# EAGLE design uvnitr-stanice (EAGLE 9.6.2)
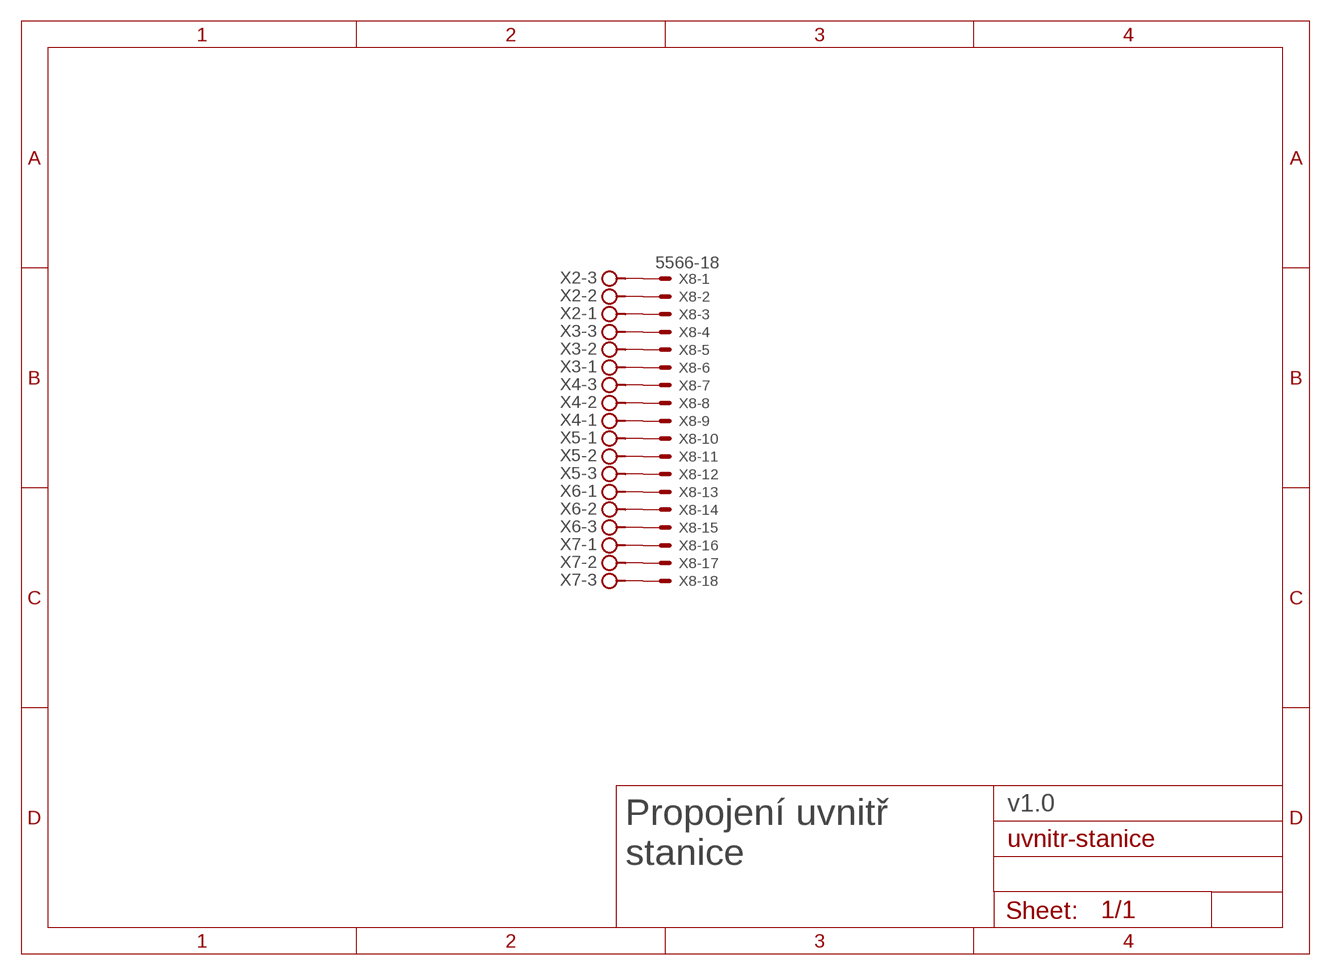
[diagram p0: schematic, sheet 1]

## Parts
X2  ARK500/3  [ARK500/3]
X3  ARK500/3  [ARK500/3]
X4  ARK500/3  [ARK500/3]
X5  ARK500/3  [ARK500/3]
X6  ARK500/3  [ARK500/3]
X7  ARK500/3  [ARK500/3]
X8  5566-18  [5566-18]

## Nets
N$1: X2.1 X8.3
N$2: X2.2 X8.2
N$3: X2.3 X8.1
N$4: X3.1 X8.6
N$5: X3.2 X8.5
N$6: X3.3 X8.4
N$7: X4.1 X8.9
N$8: X4.2 X8.8
N$9: X4.3 X8.7
N$10: X5.1 X8.10
N$11: X5.2 X8.11
N$12: X5.3 X8.12
N$13: X6.1 X8.13
N$14: X6.2 X8.14
N$15: X6.3 X8.15
N$16: X7.1 X8.16
N$17: X7.2 X8.17
N$18: X7.3 X8.18

## Notes on the sheet
- v1.0
- Propojení uvnitř
  stanice

## Library data of the parts
X2-X7 = con-malina:ARK500/3
X8 = con-molex:5566-18: Mini FIT connector 18 pol Source: http://www.molex.com; MF: MOLEX; OC_FARNELL: unknown; OC_NEWARK: unknown

## Board
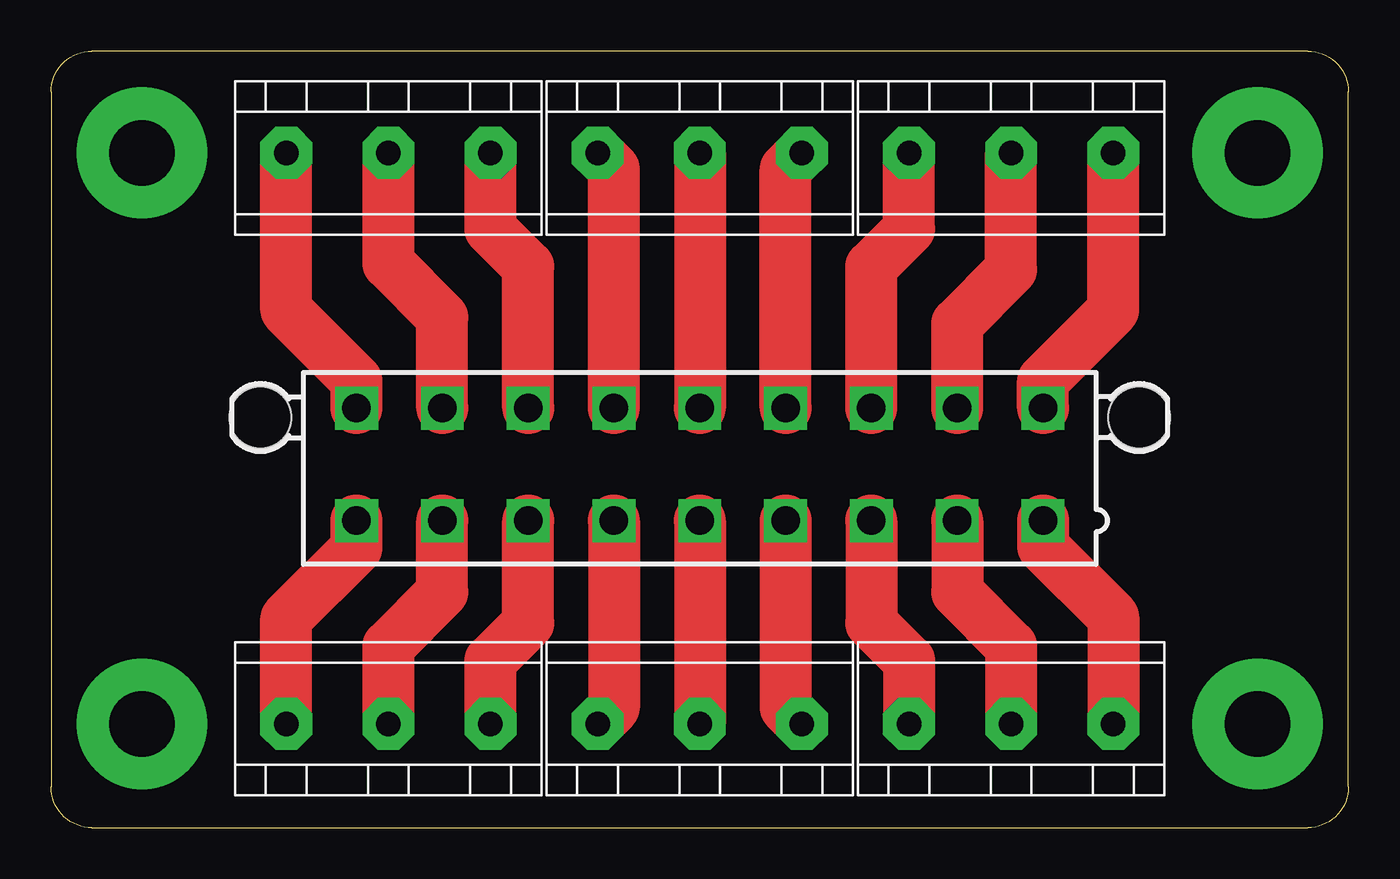
[diagram p1: board, top side]
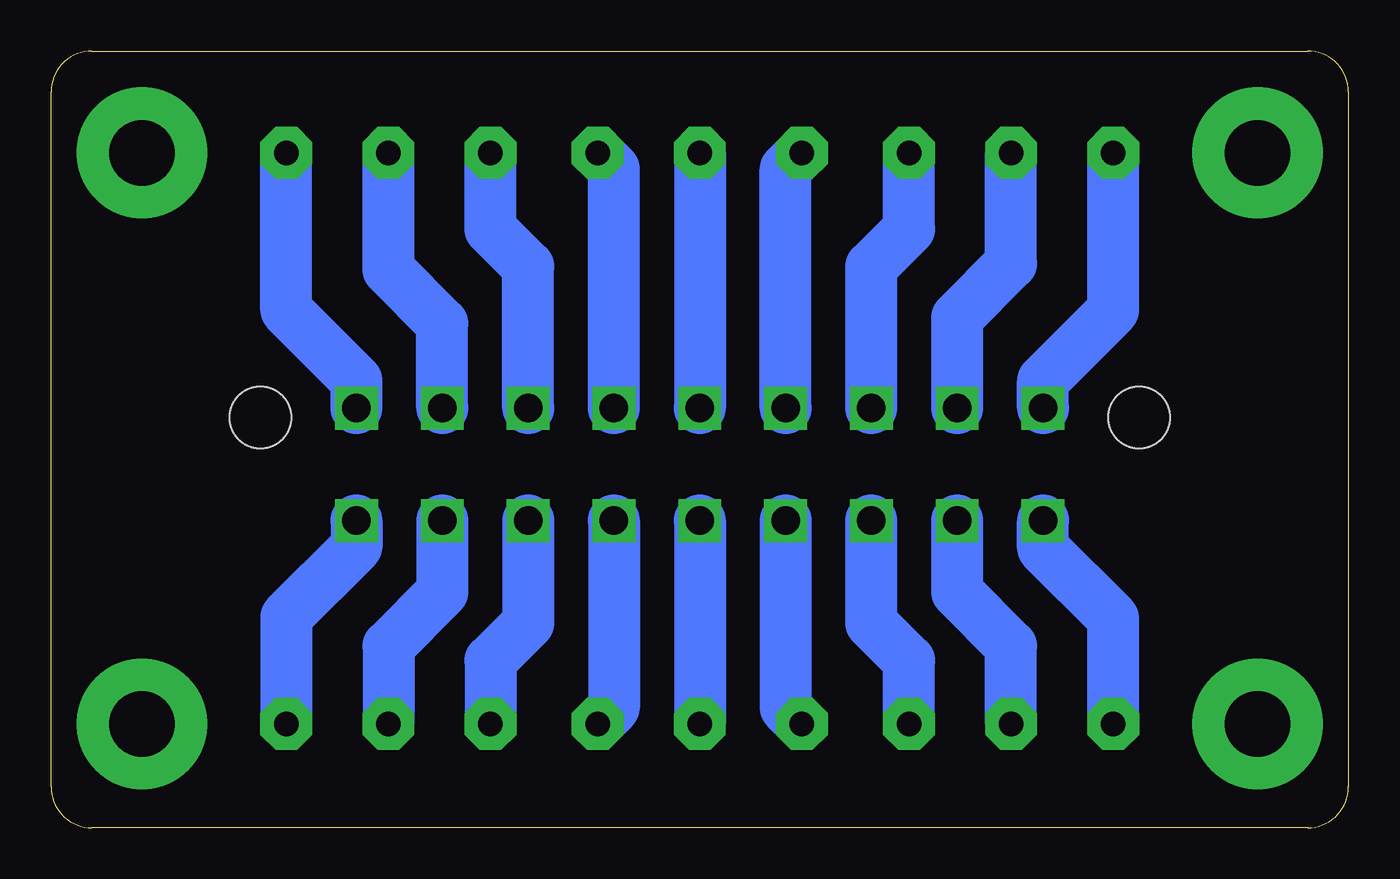
[diagram p2: board, bottom side, seen from below]

Size 63.5 x 38 mm. Coordinates in mm from the lower left corner, seen from the top.
Outline: 2,0 61.5,0 arc90 63.5,2 63.5,36 arc90 61.5,38 2,38 arc90 0,36 0,2 arc90 2,0
Copper layers (1*16): Top 0.035mm / dielectric 0.15mm / Bottom 0.035mm
Design rules "default": minimum track width 6mil, minimum drill 0.35mm, track to track 6mil, track to pad 6mil, pad to pad 6mil, via to via 6mil, smd to smd 6mil, copper to edge 40mil, drill to drill 6mil, minimum pad ring 10mil, minimum via ring 8mil, stop-mask expansion 4mil, vias tented up to drill 0mil, thermal gap 10mil

### Footprints (pad centres in the part's own frame; a part is rotated, then mirrored left to right if it is on the bottom)
ARK500/3 = drill 1.2 pad 2.54 octagon: 1 -5,0; 2 0,0; 3 5,0
5566-18 = drill 1.4 square: 1 16.8,-2.75; 2 12.6,-2.75; 3 8.4,-2.75; 4 4.2,-2.75; 5 0,-2.75; 6 -4.2,-2.75; 7 -8.4,-2.75; 8 -12.6,-2.75; 9 -16.8,-2.75; 10 16.8,2.75; 11 12.6,2.75; 12 8.4,2.75; 13 4.2,2.75; 14 0,2.75; 15 -4.2,2.75; 16 -8.4,2.75; 17 -12.6,2.75; 18 -16.8,2.75 | hole 3: 21.5,2.29; -21.5,2.29

### Placement (x,y rotation side)
X2  46.99,5.08 0 top
X3  31.75,5.08 0 top
X4  16.51,5.08 0 top
X5  46.99,33.02 180 top
X6  31.75,33.02 180 top
X7  16.51,33.02 180 top
X8  31.75,17.78 0 top

### Tracks (layer width: path | path; a pad name or v marks a point on that pad's centre or on a via)
N$1
  Bottom 2.54: X8.3 40.15,10.02 41.99,8.18 X2.1
N$2
  Bottom 2.54: X8.2 44.35,11.53 46.99,8.89 X2.2
N$3
  Bottom 2.54: X8.1 48.55,13.76 51.99,10.32 X2.3
N$4
  Bottom 2.54: X8.6 27.55,5.88 X3.1
N$5
  Bottom 2.54: X8.5 X3.2
N$6
  Bottom 2.54: X8.4 35.95,5.88 X3.3
N$7
  Bottom 2.54: X4.1 11.51,10.24 14.95,13.68 X8.9
N$8
  Bottom 2.54: X4.2 16.51,8.89 19.15,11.53 X8.8
N$9
  Bottom 2.54: X4.3 21.51,8.18 23.35,10.02 X8.7
N$10
  Bottom 2.54: X8.10 48.55,21.88 51.99,25.32 X5.1
N$11
  Bottom 2.54: X8.11 44.35,24.66 46.99,27.3 X5.2
N$12
  Bottom 2.54: X8.12 40.15,27.45 41.99,29.29 X5.3
N$13
  Bottom 2.54: X8.13 35.95,32.22 X6.1
N$14
  Bottom 2.54: X6.2 X8.14
N$15
  Bottom 2.54: X8.15 27.55,32.22 X6.3
N$16
  Bottom 2.54: X8.16 23.35,27.45 21.51,29.29 X7.1
N$17
  Bottom 2.54: X8.17 19.15,24.98 16.51,27.61 X7.2
N$18
  Bottom 2.54: X8.18 14.95,21.88 11.51,25.32 X7.3
N$19  (via drill 3.2 pad 6.4)
  other vias: 4.45,5.08
N$20  (via drill 3.2 pad 6.4)
  other vias: 4.45,33.02
N$21  (via drill 3.2 pad 6.4)
  other vias: 59.05,5.08
N$22
  Top 2.54: 48.55,20.53 48.55,21.88 51.99,25.32 51.99,33.02
N$23
  Top 2.54: 44.35,20.53 44.35,24.66 46.99,27.3 46.99,33.02
N$24
  Top 2.54: 40.15,20.53 40.15,27.45 41.99,29.29 41.99,33.02
N$25
  Top 2.54: 35.95,20.53 35.95,32.22 36.75,33.02
N$26
  Top 2.54: 31.75,33.02 31.75,20.53
N$27
  Top 2.54: 27.55,20.53 27.55,32.22 26.75,33.02
N$28
  Top 2.54: 23.35,20.53 23.35,27.45 21.51,29.29 21.51,33.02
N$29
  Top 2.54: 19.15,20.53 19.15,24.98 16.51,27.61 16.51,33.02
N$30
  Top 2.54: 14.95,20.53 14.95,21.88 11.51,25.32 11.51,33.02
N$31
  Top 2.54: 40.15,15.03 40.15,10.02 41.99,8.18 41.99,5.08
N$32
  Top 2.54: 44.35,15.03 44.35,11.53 46.99,8.89 46.99,5.08
N$33
  Top 2.54: 48.55,15.03 48.55,13.76 51.99,10.32 51.99,5.08
N$34
  Top 2.54: 27.55,15.03 27.55,5.88 26.75,5.08
N$35
  Top 2.54: 31.75,15.03 31.75,5.08
N$36
  Top 2.54: 35.95,15.03 35.95,5.88 36.75,5.08
N$37
  Top 2.54: 11.51,5.08 11.51,10.24 14.95,13.68 14.95,15.03
N$38
  Top 2.54: 16.51,5.08 16.51,8.89 19.15,11.53 19.15,15.03
N$39
  Top 2.54: 21.51,5.08 21.51,8.18 23.35,10.02 23.35,15.03
N$101  (via drill 3.2 pad 6.4)
  other vias: 59.05,33.02